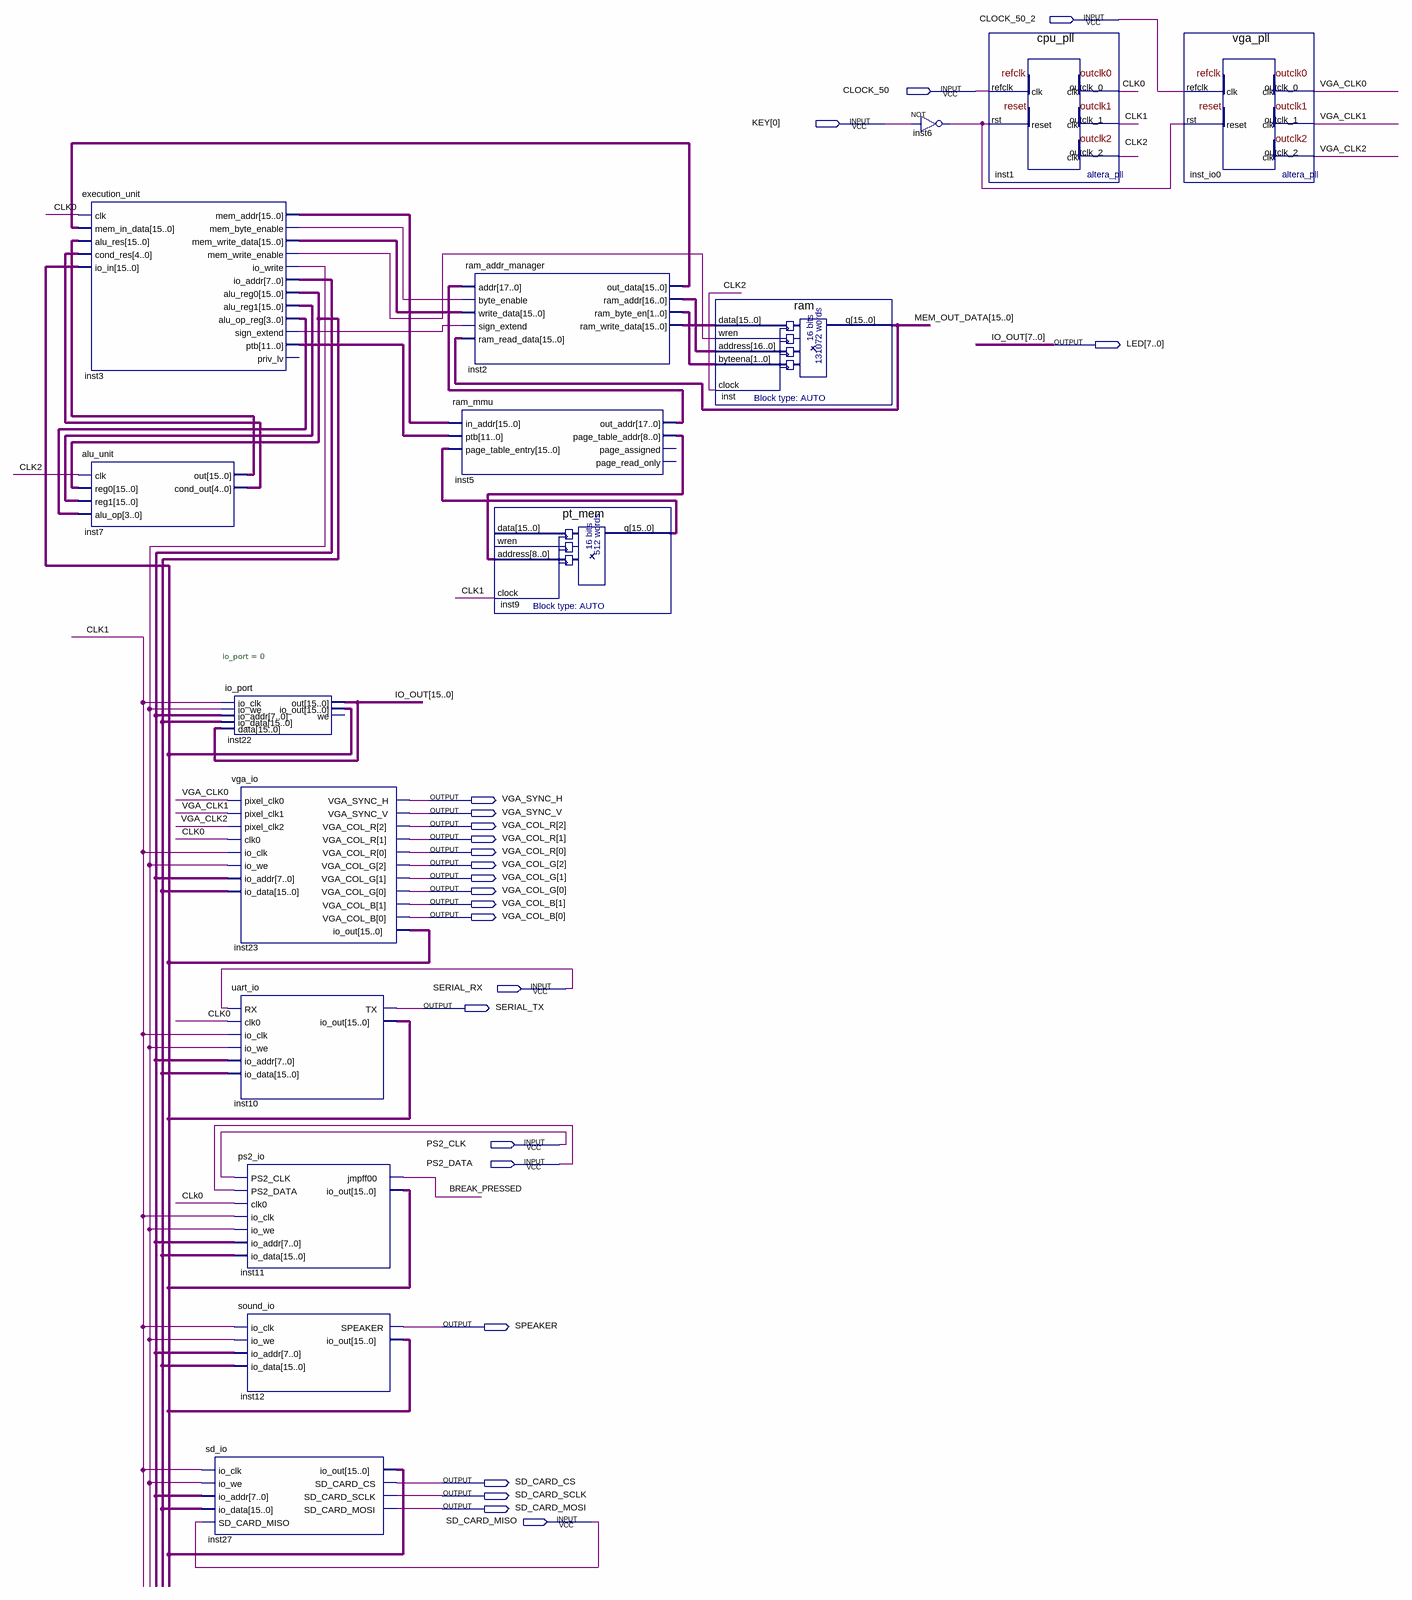
[diagram p0: schematic sheet]
// Quartus schematic scp.bdf as structural Verilog: 15 symbols, 23 pins
module scp (
  input  CLOCK_50_2,
  input  CLOCK_50,
  input  [0:0] KEY,
  input  SERIAL_RX,
  input  PS2_CLK,
  input  PS2_DATA,
  input  SD_CARD_MISO,
  output [7:0] LED,
  output VGA_SYNC_H,
  output VGA_SYNC_V,
  output [2:0] VGA_COL_R,
  output [2:0] VGA_COL_G,
  output [1:0] VGA_COL_B,
  output SERIAL_TX,
  output SPEAKER,
  output SD_CARD_CS,
  output SD_CARD_SCLK,
  output SD_CARD_MOSI
);

  wire BREAK_PRESSED, CLK0, CLK1, CLK2, inst3_io_write, inst3_mem_byte_enable, inst3_mem_write_enable,
       inst3_sign_extend, inst6_out, VGA_CLK0, VGA_CLK1, VGA_CLK2;
  wire [1:0] inst2_ram_byte_en;
  wire [3:0] inst3_alu_op_reg;
  wire [4:0] inst7_cond_out;
  wire [7:0] inst3_io_addr;
  wire [8:0] inst5_page_table_addr;
  wire [11:0] inst3_ptb;
  wire [15:0] inst2_out_data, inst2_ram_write_data, inst3_alu_reg0, inst3_alu_reg1, inst3_mem_addr,
       inst3_mem_write_data, inst7_out, inst9_q, inst27_io_out, MEM_OUT_DATA;
  wire [15:8] IO_OUT;
  wire [16:0] inst2_ram_addr;
  wire [17:0] inst5_out_addr;

  execution_unit inst3 (
    .clk(CLK0), .mem_in_data(inst2_out_data), .alu_res(inst7_out), .cond_res(inst7_cond_out),
    .io_in(inst27_io_out), .mem_addr(inst3_mem_addr), .mem_byte_enable(inst3_mem_byte_enable),
    .mem_write_data(inst3_mem_write_data), .mem_write_enable(inst3_mem_write_enable),
    .io_write(inst3_io_write), .io_addr(inst3_io_addr), .alu_reg0(inst3_alu_reg0), .alu_reg1(inst3_alu_reg1),
    .alu_op_reg(inst3_alu_op_reg), .sign_extend(inst3_sign_extend), .ptb(inst3_ptb));  // open: priv_lv
  alu_unit inst7 (
    .clk(CLK2), .reg0(inst3_alu_reg0), .reg1(inst3_alu_reg1), .alu_op(inst3_alu_op_reg), .out(inst7_out),
    .cond_out(inst7_cond_out));
  sd_io inst27 (
    .io_clk(CLK1), .io_we(inst3_io_write), .io_addr(inst3_io_addr), .io_data(inst3_alu_reg0),
    .SD_CARD_MISO(SD_CARD_MISO), .io_out(inst27_io_out), .SD_CARD_CS(SD_CARD_CS),
    .SD_CARD_SCLK(SD_CARD_SCLK), .SD_CARD_MOSI(SD_CARD_MOSI));
  io_port #(.io_port(0)) inst22 (
    .io_clk(CLK1), .io_we(inst3_io_write), .io_addr(inst3_io_addr), .io_data(inst3_alu_reg0),
    .data({IO_OUT, LED}), .out({IO_OUT, LED}), .io_out(inst27_io_out));  // open: we
  vga_io inst23 (
    .pixel_clk0(VGA_CLK0), .pixel_clk1(VGA_CLK1), .pixel_clk2(VGA_CLK2), .clk0(CLK0), .io_clk(CLK1),
    .io_we(inst3_io_write), .io_addr(inst3_io_addr), .io_data(inst3_alu_reg0), .VGA_SYNC_H(VGA_SYNC_H),
    .VGA_SYNC_V(VGA_SYNC_V), .VGA_COL_R(VGA_COL_R), .VGA_COL_G(VGA_COL_G), .VGA_COL_B(VGA_COL_B),
    .io_out(inst27_io_out));
  uart_io inst10 (
    .RX(SERIAL_RX), .clk0(CLK0), .io_clk(CLK1), .io_we(inst3_io_write), .io_addr(inst3_io_addr),
    .io_data(inst3_alu_reg0), .TX(SERIAL_TX), .io_out(inst27_io_out));
  ps2_io inst11 (
    .PS2_CLK(PS2_CLK), .PS2_DATA(PS2_DATA), .clk0(CLK0), .io_clk(CLK1), .io_we(inst3_io_write),
    .io_addr(inst3_io_addr), .io_data(inst3_alu_reg0), .jmpff00(BREAK_PRESSED), .io_out(inst27_io_out));
  sound_io inst12 (
    .io_clk(CLK1), .io_we(inst3_io_write), .io_addr(inst3_io_addr), .io_data(inst3_alu_reg0),
    .SPEAKER(SPEAKER), .io_out(inst27_io_out));
  ram_addr_manager inst2 (
    .addr(inst5_out_addr), .byte_enable(inst3_mem_byte_enable), .write_data(inst3_mem_write_data),
    .sign_extend(inst3_sign_extend), .ram_read_data(MEM_OUT_DATA), .out_data(inst2_out_data),
    .ram_addr(inst2_ram_addr), .ram_byte_en(inst2_ram_byte_en), .ram_write_data(inst2_ram_write_data));
  ram_mmu inst5 (
    .in_addr(inst3_mem_addr), .ptb(inst3_ptb), .page_table_entry(inst9_q), .out_addr(inst5_out_addr),
    .page_table_addr(inst5_page_table_addr));  // open: page_assigned, page_read_only
  pt_mem inst9 (.address(inst5_page_table_addr), .clock(CLK1), .q(inst9_q));  // open: data, wren
  ram inst (
    .data(inst2_ram_write_data), .wren(inst3_mem_write_enable), .address(inst2_ram_addr),
    .byteena(inst2_ram_byte_en), .clock(CLK2), .q(MEM_OUT_DATA));
  not inst6 (inst6_out, KEY[0]);
  cpu_pll inst1 (.refclk(CLOCK_50), .rst(inst6_out), .outclk_0(CLK0), .outclk_1(CLK1), .outclk_2(CLK2));
  vga_pll inst_io0 (
    .refclk(CLOCK_50_2), .rst(inst6_out), .outclk_0(VGA_CLK0), .outclk_1(VGA_CLK1), .outclk_2(VGA_CLK2));

  // Other names for the same wires on the sheet: IO_OUT[7:0] = LED
endmodule
